# Altium schematic sheet Lab10.SCHDOC
size 420 x 297 mm; SheetNumber: 1; SheetTotal: 1; DocumentName: Sheet1.SCHDOC
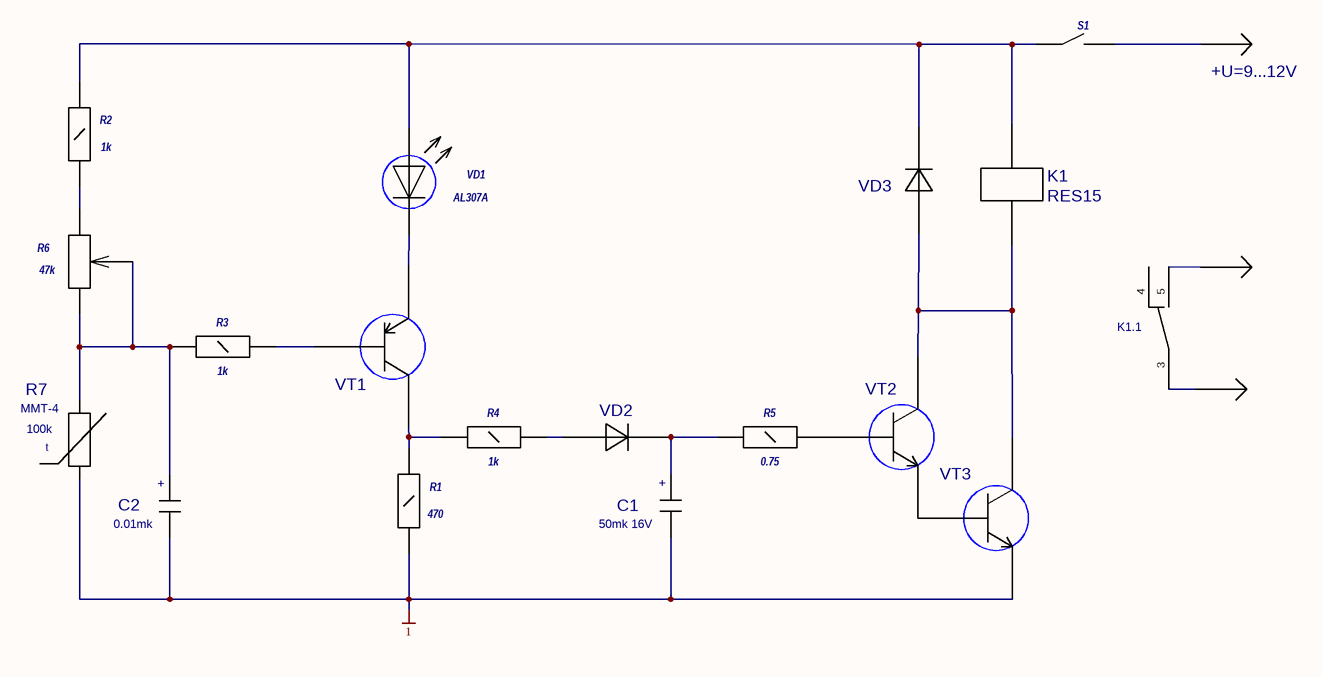
[diagram p0: Lab10.SCHDOC]

## Parts
1  value +U=9...12V  [XP_1]  (hidden comment: XP_1)
2  K1.1  [K1.1]
3  XP_1  [XP_1]  (value not drawn)
4  XP_1  [XP_1]  (value not drawn)
C1  value 50mk 16V  [CAP2]  (hidden comment: CAP2)
C2  value 0.01mk  [CAP2]  (hidden comment: CAP2)
K1  RES15  [RES15]
R1  value 470  [МЛТ(0.25)]  (hidden comment: МЛТ(0.25))
R2  value 1k  [МЛТ(0.25)]  (hidden comment: МЛТ(0.25))
R3  value 1k  [МЛТ(0.25)]  (hidden comment: МЛТ(0.25))
R4  value 1k  [МЛТ(0.25)]  (hidden comment: МЛТ(0.25))
R5  value 0.75  [МЛТ(0.25)]  (hidden comment: МЛТ(0.25))
R6  value 47k  [СП3-38В]  (hidden comment: СП3-38В)
R7  MMT-4  value 100k  [MMT-4]
S1  T1  [Т1]  (value not drawn)
VD1  AL307A  [АЛ307]
VD2  КД209  [DO-7]  (value not drawn)
VD3  КД209  [DO-7]  (value not drawn)
VT1  КТ361  [КТ315]  (value not drawn)
VT2  КТ315  [КТ315]  (value not drawn)
VT3  КТ315  [КТ315]  (value not drawn)

## Nets
1: C1.2 C2.2 R1.1 R7.2(I/O0) VT3.3(A3)
Net1_1: 1.1(A1) S1.2
Net2_3: 2.3 4.1(A1)
Net2_5: 2.5 3.1(A1)
NetC1_1: C1.1 R5.2 VD2.1(K)
NetC2_1: C2.1 R3.2 R6.2 R6.3 R7.1(I/O1)
NetK1_1: K1.1(A) R2.2 S1.1 VD1.1 VD3.1(K)
NetK1_2: K1.2(B) VD3.2(A) VT2.2(A2) VT3.2(A2)
NetR1_2: R1.2 R4.2 VT1.2(A2)
NetR2_1: R2.1 R6.1
NetR3_1: R3.1 VT1.1(A1)
NetR4_1: R4.1 VD2.2(A)
NetR5_1: R5.1 VT2.1(A1)
NetVD1_2: VD1.2 VT1.3(A3)
NetVT2_3: VT2.3(A3) VT3.1(A1)

Not connected (* = marked no-connect by the designer): 2 4; K1 3 4 5

## Notes on the sheet
- (in symbol CAP2) +
- (in symbol MMT-4) t

## Library data of the parts
2 = K1.1: Value: *